# EAGLE design Emoji Board v2 (EAGLE 7.5.0)

## Sheet 1 of 3
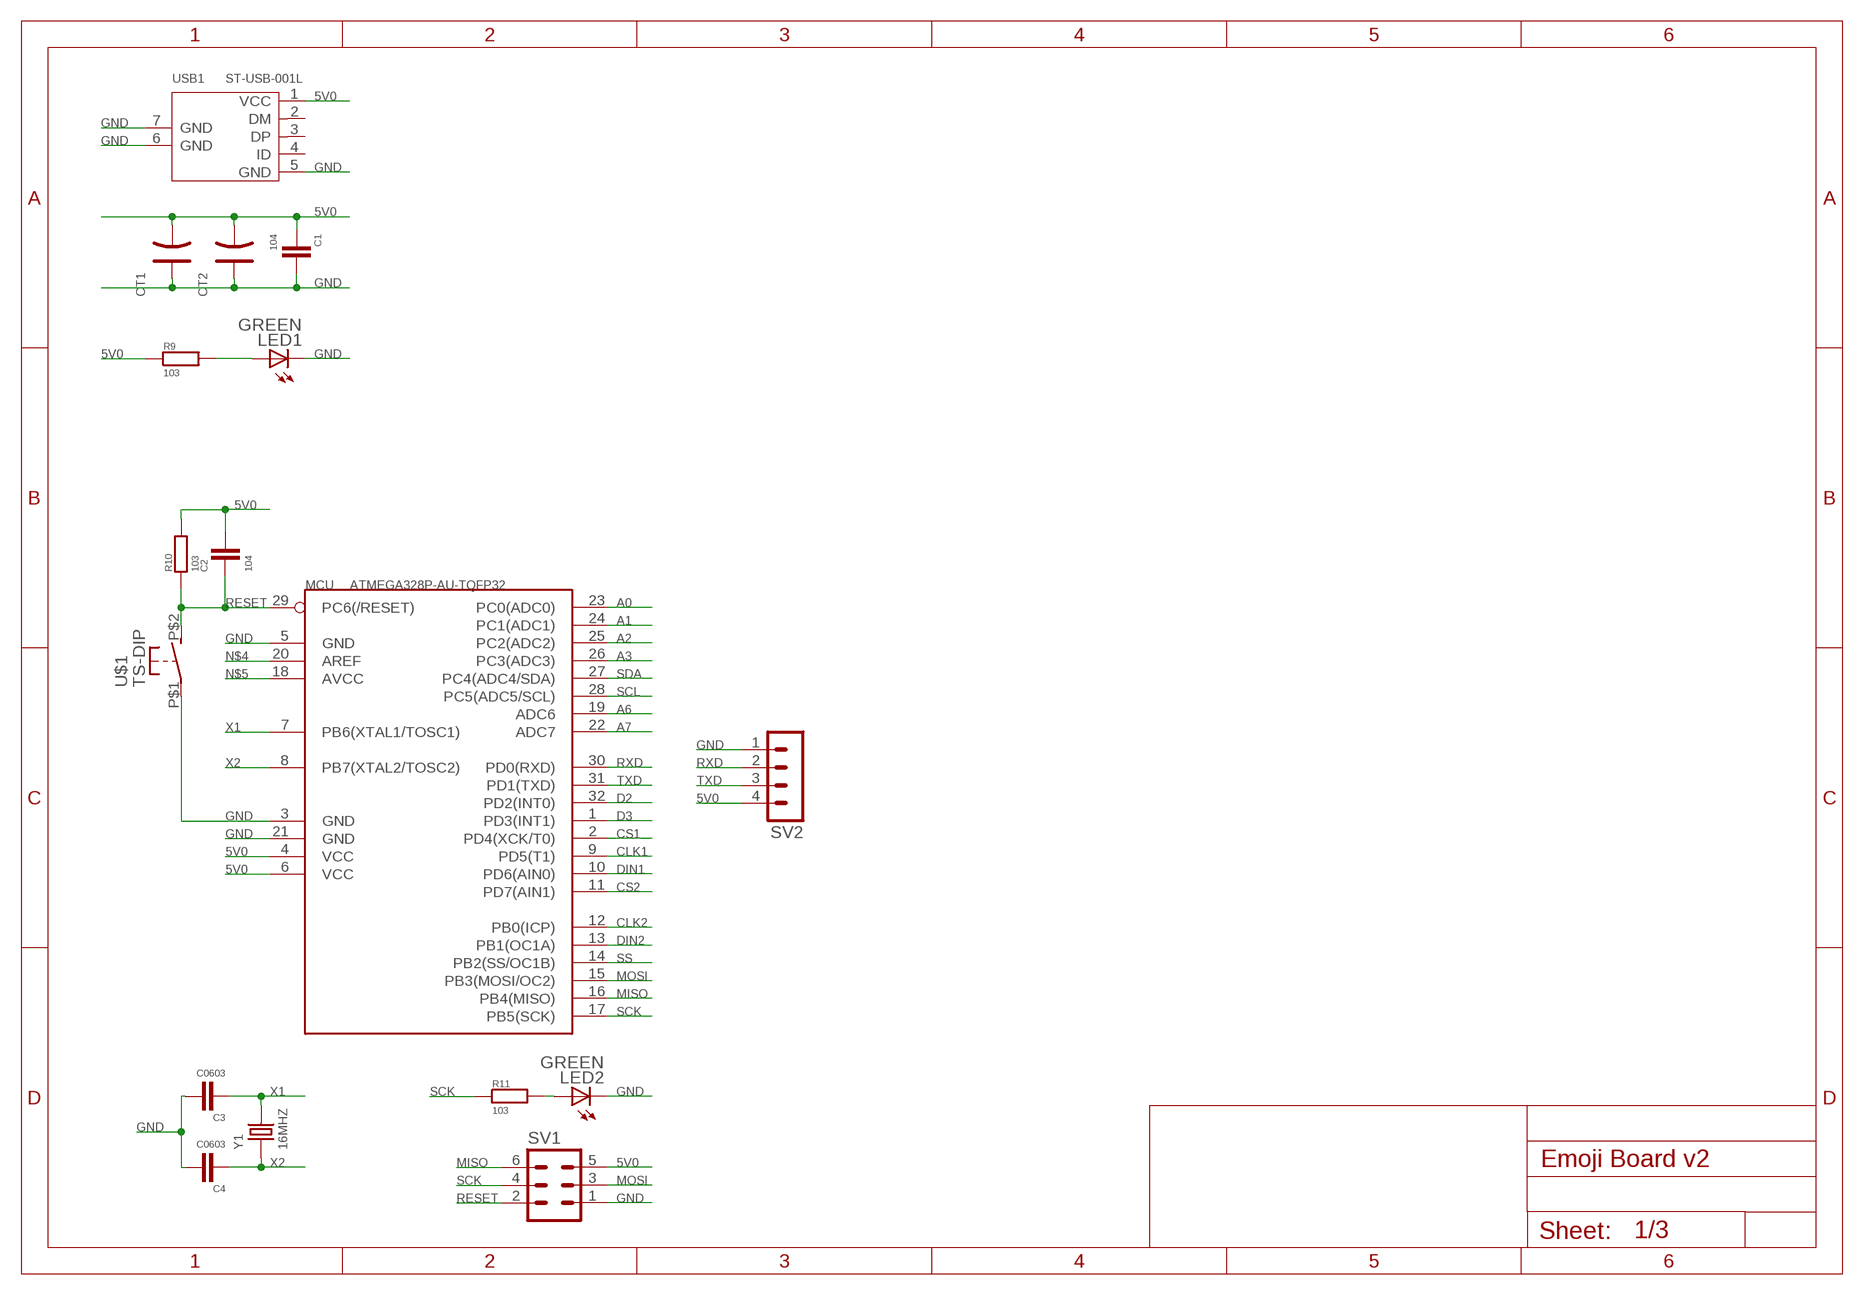
[diagram p0: schematic, sheet 1]

### Parts
C1  104  C0805  [C0805]
C2  104  C0805  [C0805]
C3  C0603  [C0603]
C4  C0603  [C0603]
CT1  ALUMINUM-SMD-100UF-50V(D6.0-H6.0MM)  [ELECTRO-SMD-C-6.0MM]
CT2  ALUMINUM-SMD-100UF-50V(D6.0-H6.0MM)  [ELECTRO-SMD-C-6.0MM]
LED1  GREEN  LEDCHIPLED_0805  [LED0805]
LED2  GREEN  LEDCHIPLED_0805  [LED0805]
MCU  ATMEGA328P-AU-TQFP32  ATMEGA328P-AU  [TQFP32]
R9  103  R0805  [R0805]
R10  103  R0805  [R0805]
R11  103  R0805  [R0805]
SV1  MA03-2  [MA03-2]
SV2  MA04-1  [MA04-1]
U$1  TS-DIP  [TS-DIP]
USB1  ST-USB-001L  MICRO-USB-SMD-5+2  [MICRO-USB-SMD-5+2]
Y1  16MHZ  DIP-CRYSTAL-16MHZ-18PF-30PPM-40R(HC49US)  [HC49US]

### Nets
5V0: C1.2 C2.1 CT1.- CT2.- MCU.4(VCC) MCU.6(VCC) R9.1 R10.2 SV1.5 SV2.4 USB1.1(VCC) ; also sheet 2,3
A0: MCU.23(PC0(ADC0))
A1: MCU.24(PC1(ADC1))
A2: MCU.25(PC2(ADC2))
A3: MCU.26(PC3(ADC3))
A6: MCU.19(ADC6)
A7: MCU.22(ADC7)
CLK1: MCU.9(PD5(T1)) ; also sheet 2
CLK2: MCU.12(PB0(ICP)) ; also sheet 3
CS1: MCU.2(PD4(XCK/T0)) ; also sheet 2
CS2: MCU.11(PD7(AIN1)) ; also sheet 3
D2: MCU.32(PD2(INT0))
D3: MCU.1(PD3(INT1))
DIN1: MCU.10(PD6(AIN0)) ; also sheet 2
DIN2: MCU.13(PB1(OC1A)) ; also sheet 3
GND: C1.1 C3.1 C4.1 CT1.+ CT2.+ LED1.C LED2.C MCU.3(GND) MCU.5(GND) MCU.21(GND) SV1.1 SV2.1 U$1.P$1(P) USB1.5(GND) USB1.6(GND) USB1.7(GND) ; also sheet 2,3
MISO: MCU.16(PB4(MISO)) SV1.6
MOSI: MCU.15(PB3(MOSI/OC2)) SV1.3
N$1: LED1.A R9.2
N$3: LED2.A R11.2
N$4: MCU.20(AREF)
N$5: MCU.18(AVCC)
RESET: C2.2 MCU.29(PC6(/RESET)) R10.1 SV1.2 U$1.P$2(S)
RXD: MCU.30(PD0(RXD)) SV2.2
SCK: MCU.17(PB5(SCK)) R11.1 SV1.4
SCL: MCU.28(PC5(ADC5/SCL))
SDA: MCU.27(PC4(ADC4/SDA))
SS: MCU.14(PB2(SS/OC1B))
TXD: MCU.31(PD1(TXD)) SV2.3
X1: C3.2 MCU.7(PB6(XTAL1/TOSC1)) Y1.2
X2: C4.2 MCU.8(PB7(XTAL2/TOSC2)) Y1.1
Unconnected: USB1.2(DM) USB1.3(DP) USB1.4(ID)

## Sheet 2 of 3
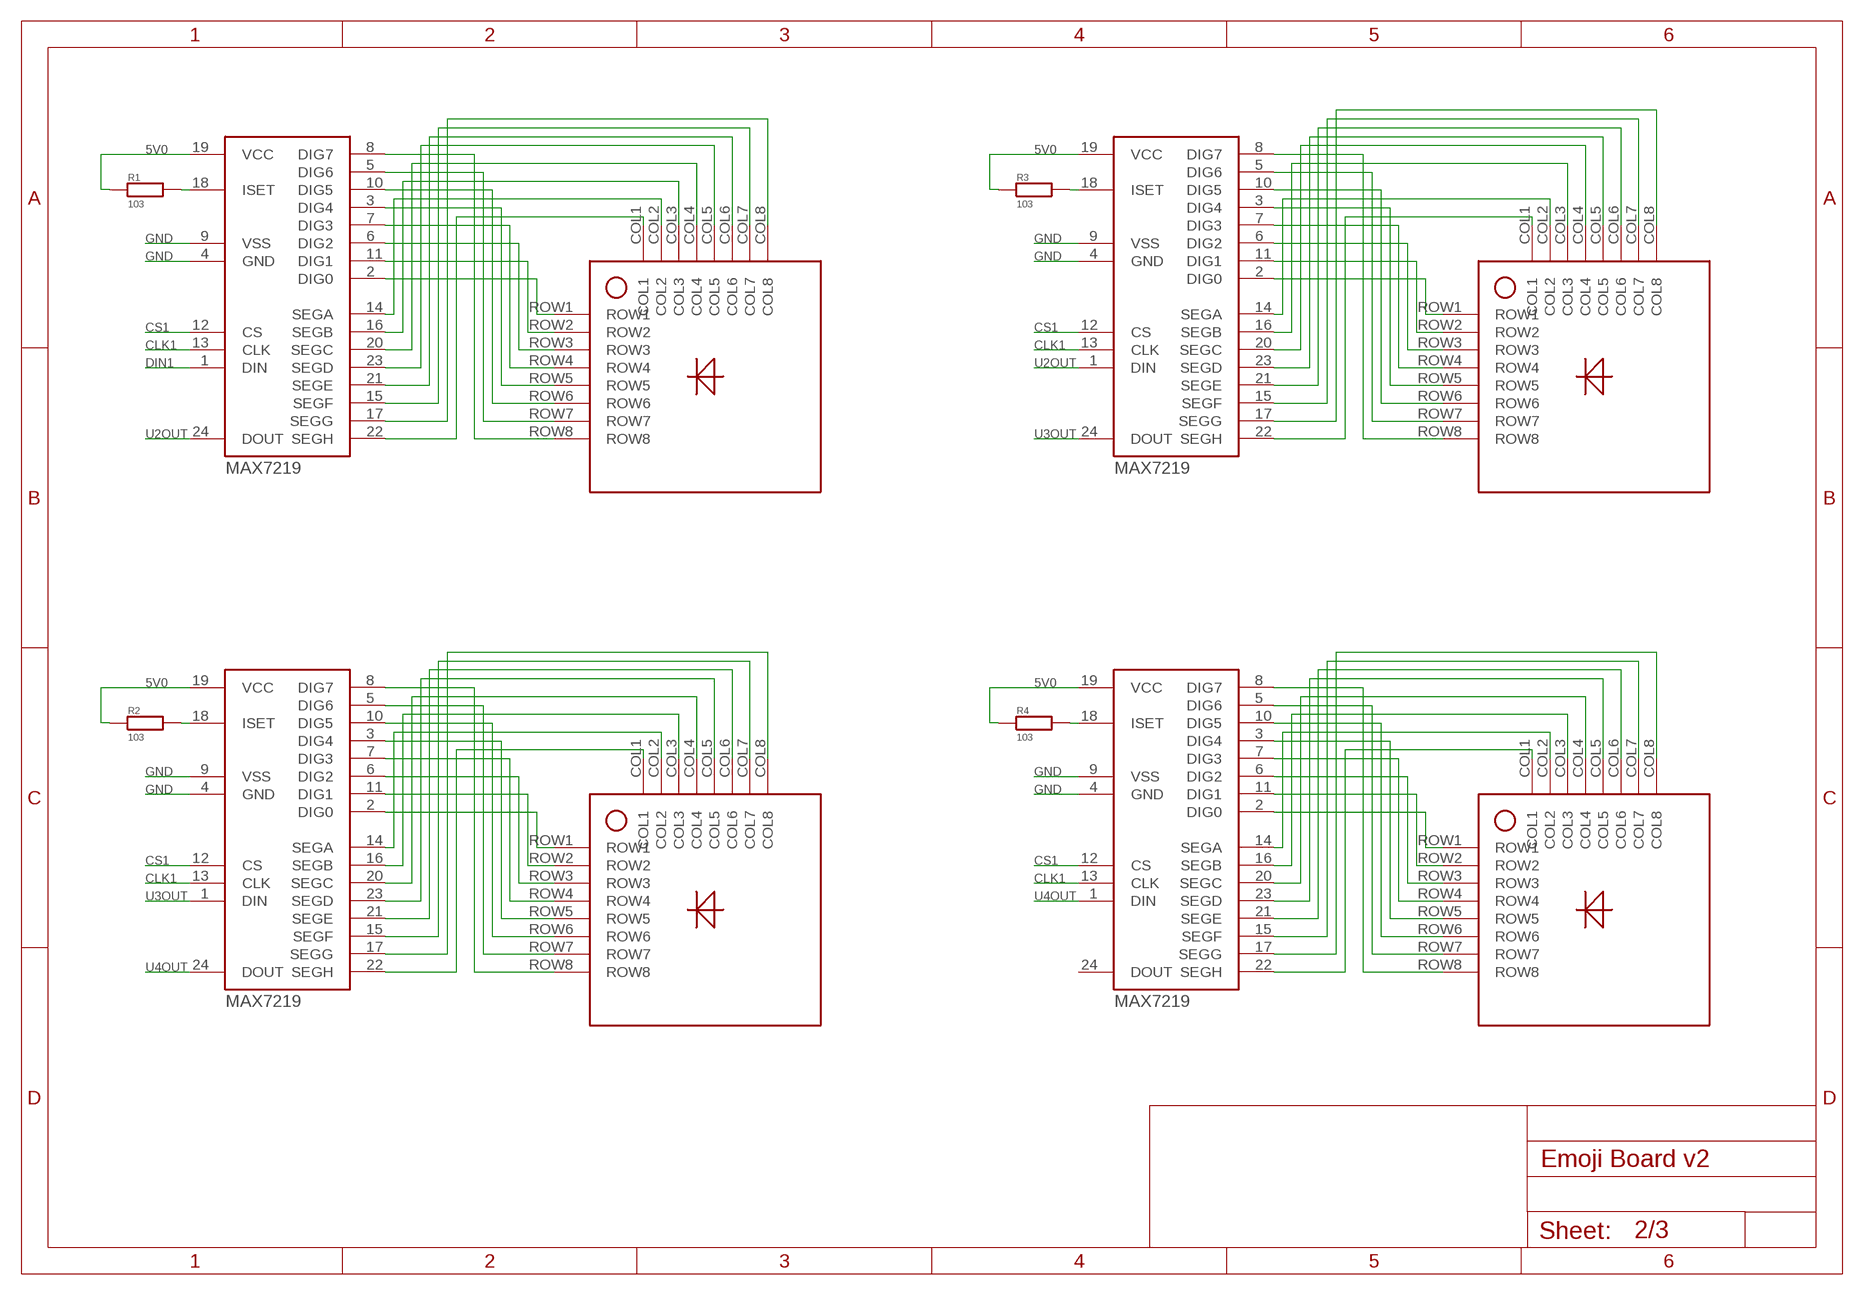
[diagram p1: schematic, sheet 2]

### Parts
R1  103  R0805  [R0805]
R2  103  R0805  [R0805]
R3  103  R0805  [R0805]
R4  103  R0805  [R0805]
T1  DOT-MATRIX-AS  [1088AS]
T2  DOT-MATRIX-AS  [1088AS]
T3  DOT-MATRIX-AS  [1088AS]
T4  DOT-MATRIX-AS  [1088AS]
U2  MAX7219  [SOP24]
U3  MAX7219  [SOP24]
U4  MAX7219  [SOP24]
U5  MAX7219  [SOP24]

### Nets
5V0: R1.1 R2.1 R3.1 R4.1 U2.19(VCC) U3.19(VCC) U4.19(VCC) U5.19(VCC) ; also sheet 1,3
CLK1: U2.13(CLK) U3.13(CLK) U4.13(CLK) U5.13(CLK) ; also sheet 1
CS1: U2.12(CS) U3.12(CS) U4.12(CS) U5.12(CS) ; also sheet 1
DIN1: U2.1(DIN) ; also sheet 1
GND: U2.4(GND) U2.9(VSS) U3.4(GND) U3.9(VSS) U4.4(GND) U4.9(VSS) U5.4(GND) U5.9(VSS) ; also sheet 1,3
N$8: T1.ROW1 U2.2(DIG0)
N$9: T1.ROW2 U2.11(DIG1)
N$10: T1.ROW3 U2.6(DIG2)
N$11: T1.ROW4 U2.7(DIG3)
N$12: T1.ROW5 U2.3(DIG4)
N$13: T1.ROW6 U2.10(DIG5)
N$14: T1.ROW7 U2.5(DIG6)
N$15: T1.ROW8 U2.8(DIG7)
N$16: T1.COL1 U2.22(SEGH)
N$17: T1.COL2 U2.14(SEGA)
N$18: T1.COL3 U2.16(SEGB)
N$19: T1.COL4 U2.20(SEGC)
N$20: T1.COL5 U2.23(SEGD)
N$21: T1.COL6 U2.21(SEGE)
N$22: T1.COL7 U2.15(SEGF)
N$23: T1.COL8 U2.17(SEGG)
N$33: T2.ROW1 U3.2(DIG0)
N$34: T2.ROW2 U3.11(DIG1)
N$35: T2.ROW3 U3.6(DIG2)
N$36: T2.ROW4 U3.7(DIG3)
N$37: T2.ROW5 U3.3(DIG4)
N$38: T2.ROW6 U3.10(DIG5)
N$39: T2.ROW7 U3.5(DIG6)
N$40: T2.ROW8 U3.8(DIG7)
N$41: T2.COL1 U3.22(SEGH)
N$42: T2.COL2 U3.14(SEGA)
N$43: T2.COL3 U3.16(SEGB)
N$44: T2.COL4 U3.20(SEGC)
N$45: T2.COL5 U3.23(SEGD)
N$46: T2.COL6 U3.21(SEGE)
N$47: T2.COL7 U3.15(SEGF)
N$48: T2.COL8 U3.17(SEGG)
N$49: T3.ROW1 U4.2(DIG0)
N$50: T3.ROW2 U4.11(DIG1)
N$51: T3.ROW3 U4.6(DIG2)
N$52: T3.ROW4 U4.7(DIG3)
N$53: T3.ROW5 U4.3(DIG4)
N$54: T3.ROW6 U4.10(DIG5)
N$55: T3.ROW7 U4.5(DIG6)
N$56: T3.ROW8 U4.8(DIG7)
N$57: T3.COL1 U4.22(SEGH)
N$58: T3.COL2 U4.14(SEGA)
N$59: T3.COL3 U4.16(SEGB)
N$60: T3.COL4 U4.20(SEGC)
N$61: T3.COL5 U4.23(SEGD)
N$62: T3.COL6 U4.21(SEGE)
N$63: T3.COL7 U4.15(SEGF)
N$64: T3.COL8 U4.17(SEGG)
N$65: T4.ROW1 U5.2(DIG0)
N$66: T4.ROW2 U5.11(DIG1)
N$67: T4.ROW3 U5.6(DIG2)
N$68: T4.ROW4 U5.7(DIG3)
N$69: T4.ROW5 U5.3(DIG4)
N$70: T4.ROW6 U5.10(DIG5)
N$71: T4.ROW7 U5.5(DIG6)
N$72: T4.ROW8 U5.8(DIG7)
N$73: T4.COL1 U5.22(SEGH)
N$74: T4.COL2 U5.14(SEGA)
N$75: T4.COL3 U5.16(SEGB)
N$76: T4.COL4 U5.20(SEGC)
N$77: T4.COL5 U5.23(SEGD)
N$78: T4.COL6 U5.21(SEGE)
N$79: T4.COL7 U5.15(SEGF)
N$80: T4.COL8 U5.17(SEGG)
N$86: R1.2 U2.18(ISET)
N$87: R2.2 U4.18(ISET)
N$88: R3.2 U3.18(ISET)
N$89: R4.2 U5.18(ISET)
U2OUT: U2.24(DOUT) U3.1(DIN)
U3OUT: U3.24(DOUT) U4.1(DIN)
U4OUT: U4.24(DOUT) U5.1(DIN)
Unconnected: U5.24(DOUT)

## Sheet 3 of 3
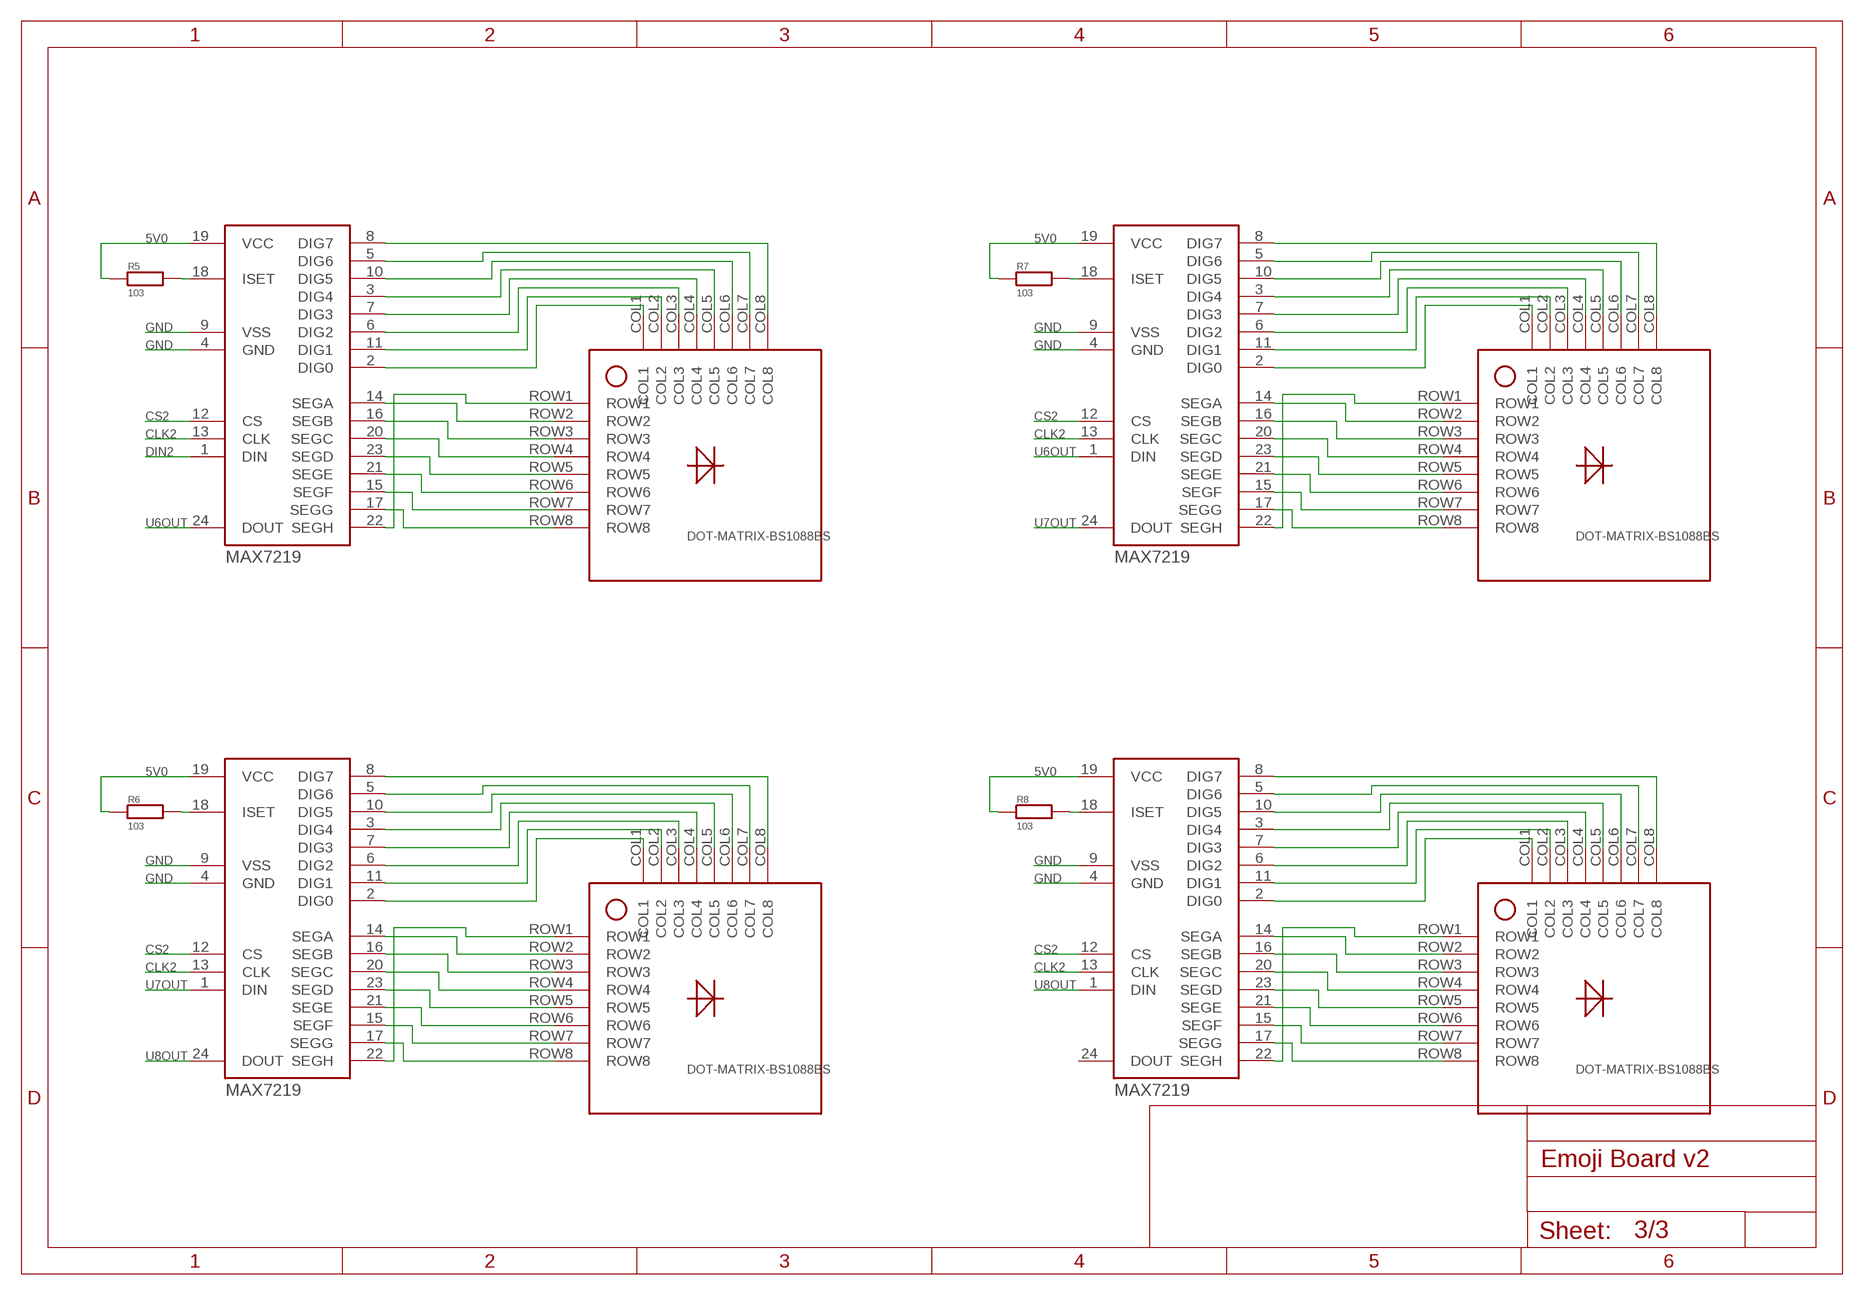
[diagram p2: schematic, sheet 3]

### Parts
R5  103  R0805  [R0805]
R6  103  R0805  [R0805]
R7  103  R0805  [R0805]
R8  103  R0805  [R0805]
T5  DOT-MATRIX-BS1088BS  [1088BS]
T6  DOT-MATRIX-BS1088BS  [1088BS]
T7  DOT-MATRIX-BS1088BS  [1088BS]
T8  DOT-MATRIX-BS1088BS  [1088BS]
U6  MAX7219  [SOP24]
U7  MAX7219  [SOP24]
U8  MAX7219  [SOP24]
U9  MAX7219  [SOP24]

### Nets
5V0: R5.1 R6.1 R7.1 R8.1 U6.19(VCC) U7.19(VCC) U8.19(VCC) U9.19(VCC) ; also sheet 1,2
CLK2: U6.13(CLK) U7.13(CLK) U8.13(CLK) U9.13(CLK) ; also sheet 1
CS2: U6.12(CS) U7.12(CS) U8.12(CS) U9.12(CS) ; also sheet 1
DIN2: U6.1(DIN) ; also sheet 1
GND: U6.4(GND) U6.9(VSS) U7.4(GND) U7.9(VSS) U8.4(GND) U8.9(VSS) U9.4(GND) U9.9(VSS) ; also sheet 1,2
N$2: R5.2 U6.18(ISET)
N$25: R6.2 U8.18(ISET)
N$81: T5.ROW8 U6.17(SEGG)
N$82: T5.ROW7 U6.15(SEGF)
N$83: T5.ROW6 U6.21(SEGE)
N$84: T5.ROW5 U6.23(SEGD)
N$85: T5.ROW4 U6.20(SEGC)
N$90: T5.ROW3 U6.16(SEGB)
N$91: T5.ROW2 U6.14(SEGA)
N$92: T5.ROW1 U6.22(SEGH)
N$93: T5.COL1 U6.2(DIG0)
N$94: T5.COL2 U6.11(DIG1)
N$95: T5.COL3 U6.6(DIG2)
N$96: T5.COL4 U6.7(DIG3)
N$97: T5.COL5 U6.3(DIG4)
N$98: T5.COL6 U6.10(DIG5)
N$99: T5.COL7 U6.5(DIG6)
N$100: T5.COL8 U6.8(DIG7)
N$101: T6.ROW8 U7.17(SEGG)
N$102: T6.ROW7 U7.15(SEGF)
N$103: T6.ROW6 U7.21(SEGE)
N$104: T6.ROW5 U7.23(SEGD)
N$105: T6.ROW4 U7.20(SEGC)
N$106: T6.ROW3 U7.16(SEGB)
N$107: T6.ROW2 U7.14(SEGA)
N$108: T6.ROW1 U7.22(SEGH)
N$109: T6.COL1 U7.2(DIG0)
N$110: T6.COL2 U7.11(DIG1)
N$111: T6.COL3 U7.6(DIG2)
N$112: T6.COL4 U7.7(DIG3)
N$113: T6.COL5 U7.3(DIG4)
N$114: T6.COL6 U7.10(DIG5)
N$115: T6.COL7 U7.5(DIG6)
N$116: T6.COL8 U7.8(DIG7)
N$117: T8.ROW8 U9.17(SEGG)
N$118: T8.ROW7 U9.15(SEGF)
N$119: T8.ROW6 U9.21(SEGE)
N$120: T8.ROW5 U9.23(SEGD)
N$121: T8.ROW4 U9.20(SEGC)
N$122: T8.ROW3 U9.16(SEGB)
N$123: T8.ROW2 U9.14(SEGA)
N$124: T8.ROW1 U9.22(SEGH)
N$125: T8.COL1 U9.2(DIG0)
N$126: T8.COL2 U9.11(DIG1)
N$127: T8.COL3 U9.6(DIG2)
N$128: T8.COL4 U9.7(DIG3)
N$129: T8.COL5 U9.3(DIG4)
N$130: T8.COL6 U9.10(DIG5)
N$131: T8.COL7 U9.5(DIG6)
N$132: T8.COL8 U9.8(DIG7)
N$133: T7.ROW8 U8.17(SEGG)
N$134: T7.ROW7 U8.15(SEGF)
N$135: T7.ROW6 U8.21(SEGE)
N$136: T7.ROW5 U8.23(SEGD)
N$137: T7.ROW4 U8.20(SEGC)
N$138: T7.ROW3 U8.16(SEGB)
N$139: T7.ROW2 U8.14(SEGA)
N$140: T7.ROW1 U8.22(SEGH)
N$141: T7.COL1 U8.2(DIG0)
N$142: T7.COL2 U8.11(DIG1)
N$143: T7.COL3 U8.6(DIG2)
N$144: T7.COL4 U8.7(DIG3)
N$145: T7.COL5 U8.3(DIG4)
N$146: T7.COL6 U8.10(DIG5)
N$147: T7.COL7 U8.5(DIG6)
N$148: T7.COL8 U8.8(DIG7)
N$149: R7.2 U7.18(ISET)
N$150: R8.2 U9.18(ISET)
U6OUT: U6.24(DOUT) U7.1(DIN)
U7OUT: U7.24(DOUT) U8.1(DIN)
U8OUT: U8.24(DOUT) U9.1(DIN)
Unconnected: U9.24(DOUT)

## Library data of the parts
C1-C4 = RCLDA:C: CAPACITOR
CT1 CT2 = RCLDA:ALUMINUM-SMD-100UF-50V(D6.0-H6.0MM): 302030090; MPN: CS1H101M-CRE77; VALUE: 100UF
LED1 LED2 = Display:LED
MCU = Chip:ATMEGA328P-AU: 310010049; MPN: ATMEGA328P-AU
R1-R11 = RCLDA:R: RESISTOR
SV1 = Pin-Header:MA03-2: PIN HEADER; OC_FARNELL: unknown; OC_NEWARK: unknown
SV2 = Pin-Header:MA04-1: PIN HEADER; OC_FARNELL: unknown; OC_NEWARK: unknown
T1-T4 = Display:DOT-MATRIX-AS
T5-T8 = Display:DOT-MATRIX-BS
U2-U9 = Chip:MAX7219
U$1 = Button:TS-DIP
USB1 = Socket:MICRO-USB-SMD-5+2: 320010012; MPN: ST-USB-001L
Y1 = Crystal:DIP-CRYSTAL-16MHZ-18PF-30PPM-40R(HC49US): 306010014; MPN: HC-49US 16.000MHz

## Board
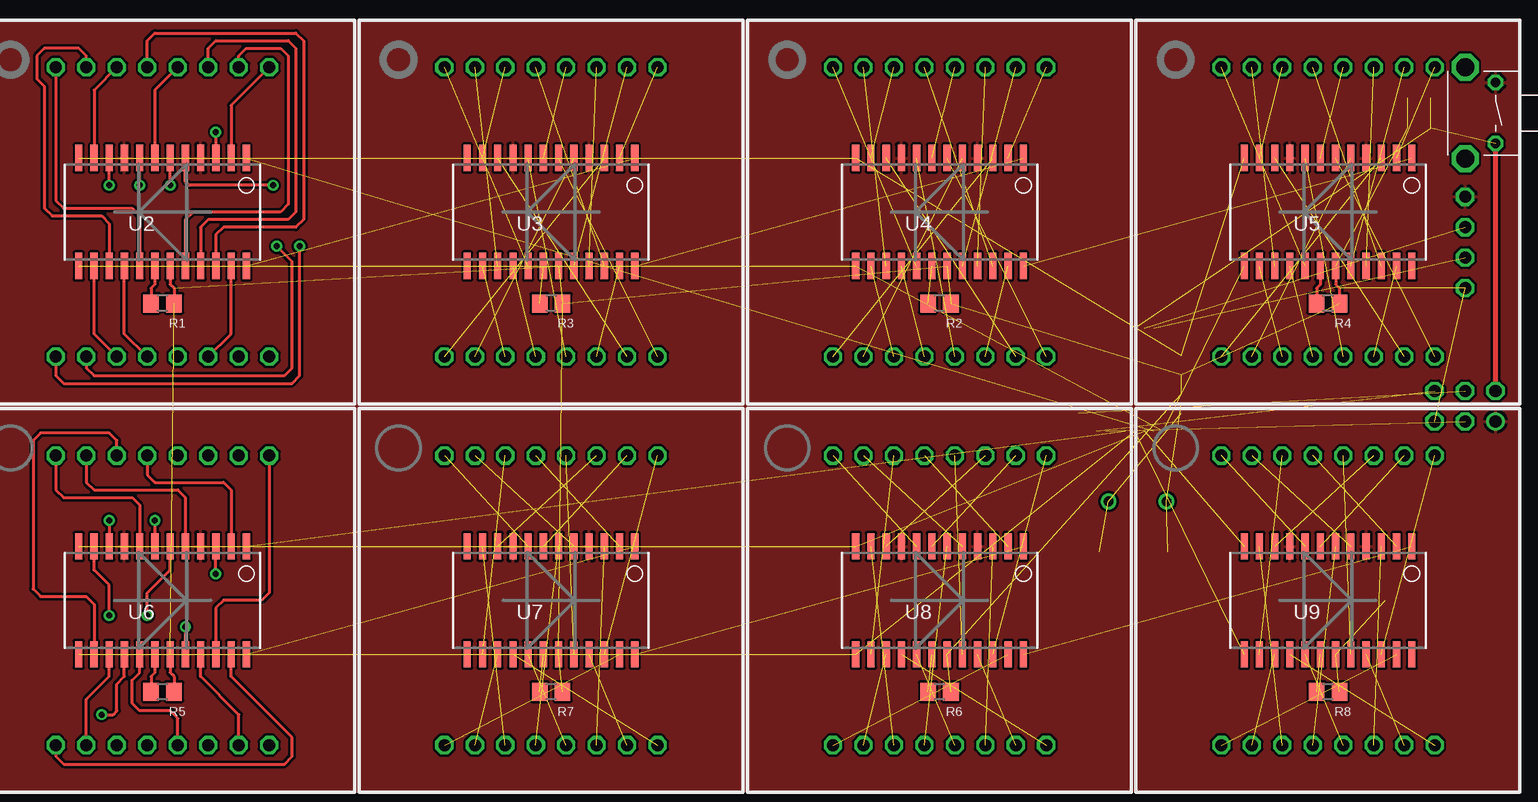
[diagram p3: board, top side]
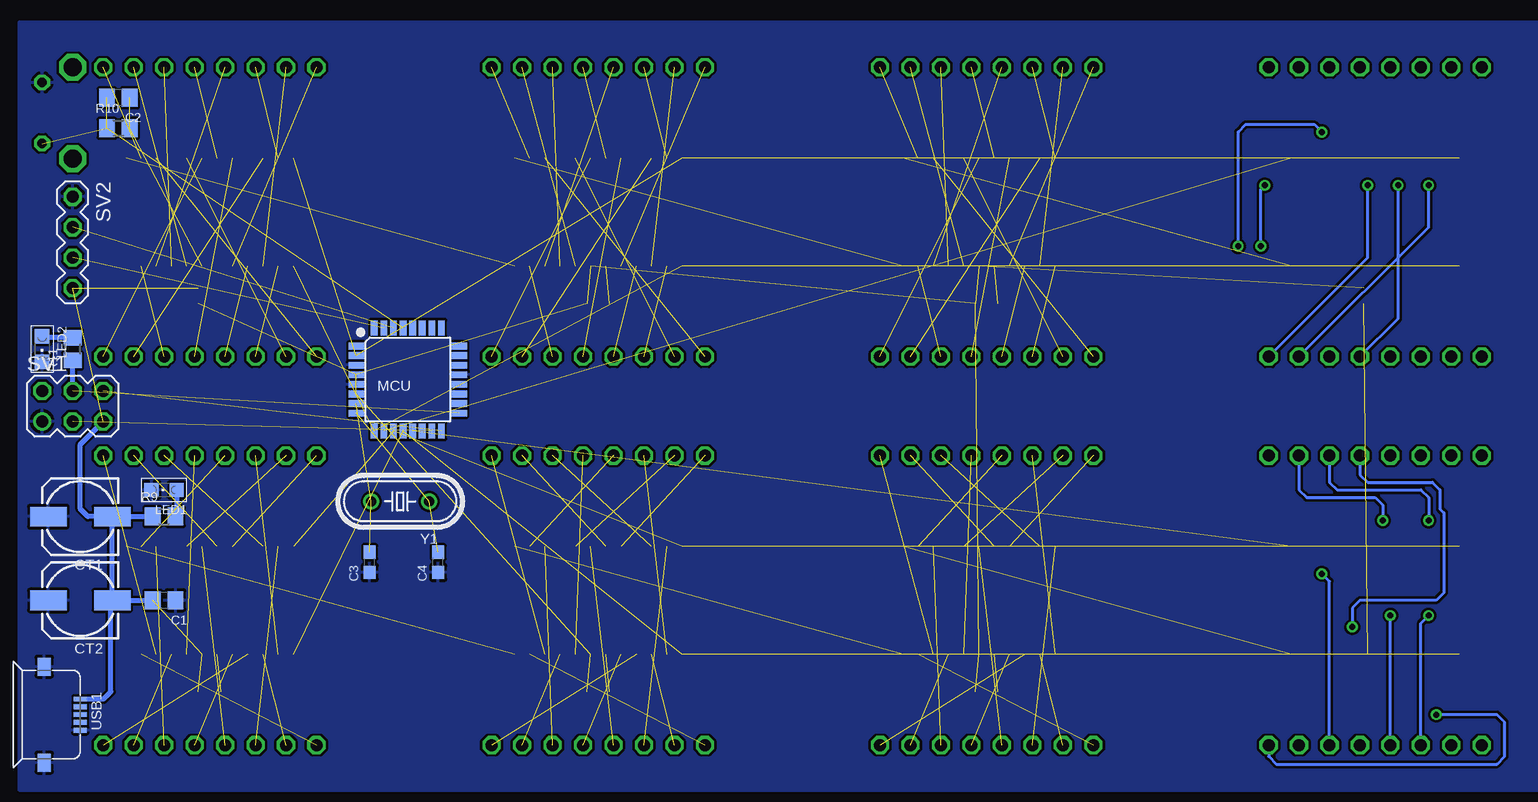
[diagram p4: board, bottom side, seen from below]

No outline drawn. Coordinates in mm, seen from the top.
Copper layers (1*16): Top 0.035mm / dielectric 1.5mm / Bottom 0.035mm
Design rules "default": minimum track width 10mil, minimum drill 24mil, track to track 8mil, track to pad 8mil, pad to pad 8mil, via to via 8mil, smd to smd 8mil, copper to edge 40mil, drill to drill 8mil, minimum pad ring 10mil, minimum via ring 8mil, stop-mask expansion 4mil, vias tented up to drill 0mil, thermal gap 10mil

### Footprints (pad centres in the part's own frame; a part is rotated, then mirrored left to right if it is on the bottom)
C0805 = smd 1.3 x 1.5: 1 -0.95,0; 2 0.95,0
C0603 = smd 1.1 x 1: 1 -0.85,0; 2 0.85,0
ELECTRO-SMD-C-6.0MM = smd 3.048 x 1.651: + 2.667,0; - -2.667,0
LED0805 = smd 1.2 x 1.2: A -1.05,0; C 1.05,0
TQFP32 = smd 1.27 x 0.559: 1 -4.293,2.8; 2 -4.293,2; 3 -4.293,1.2; 4 -4.293,0.4; 5 -4.293,-0.4; 6 -4.293,-1.2; 7 -4.293,-2; 8 -4.293,-2.8; 17 4.293,-2.8; 18 4.293,-2; 19 4.293,-1.2; 20 4.293,-0.4; 21 4.293,0.4; 22 4.293,1.2; 23 4.293,2; 24 4.293,2.8 | smd 0.559 x 1.27: 9 -2.8,-4.293; 10 -2,-4.293; 11 -1.2,-4.293; 12 -0.4,-4.293; 13 0.4,-4.293; 14 1.2,-4.293; 15 2,-4.293; 16 2.8,-4.293; 25 2.8,4.293; 26 2,4.293; 27 1.2,4.293; 28 0.4,4.293; 29 -0.4,4.293; 30 -1.2,4.293; 31 -2,4.293; 32 -2.8,4.293
R0805 = smd 1.3 x 1.5: 1 -0.95,0; 2 0.95,0
MA03-2 = drill 1.016: 1 -2.54,-1.27 | drill 1.016 octagon: 2 -2.54,1.27; 3 0,-1.27; 4 0,1.27; 5 2.54,-1.27; 6 2.54,1.27
MA04-1 = drill 1.016 octagon: 1 -3.81,0; 2 -1.27,0; 3 1.27,0; 4 3.81,0
1088AS = drill 1 octagon: COL1 -1.27,12.065; COL2 -3.81,-12.065; COL3 -1.27,-12.065; COL4 6.35,12.065; COL5 3.81,-12.065; COL6 3.81,12.065; COL7 -6.35,12.065; COL8 -8.89,12.065; ROW1 8.89,12.065; ROW2 -3.81,12.065; ROW3 8.89,-12.065; ROW4 1.27,12.065; ROW5 -8.89,-12.065; ROW6 6.35,-12.065; ROW7 -6.35,-12.065; ROW8 1.27,-12.065
1088BS = drill 1 octagon: COL1 -1.27,12.065; COL2 -3.81,-12.065; COL3 -1.27,-12.065; COL4 6.35,12.065; COL5 3.81,-12.065; COL6 3.81,12.065; COL7 -6.35,12.065; COL8 -8.89,12.065; ROW1 8.89,12.065; ROW2 -3.81,12.065; ROW3 8.89,-12.065; ROW4 1.27,12.065; ROW5 -8.89,-12.065; ROW6 6.35,-12.065; ROW7 -6.35,-12.065; ROW8 1.27,-12.065
SOP24 = smd 0.6 x 2.2: 1 -6.985,-4.5; 2 -5.715,-4.5; 3 -4.445,-4.5; 4 -3.175,-4.5; 5 -1.905,-4.5; 6 -0.635,-4.5; 7 0.635,-4.5; 8 1.905,-4.5; 9 3.175,-4.5; 10 4.445,-4.5; 11 5.715,-4.5; 12 6.985,-4.5; 13 6.985,4.5; 14 5.715,4.5; 15 4.445,4.5; 16 3.175,4.5; 17 1.905,4.5; 18 0.635,4.5; 19 -0.635,4.5; 20 -1.905,4.5; 21 -3.175,4.5; 22 -4.445,4.5; 23 -5.715,4.5; 24 -6.985,4.5
TS-DIP = drill 0.8 octagon: P$1 -2.54,0; P$2 2.54,0 | drill 1.5 octagon: P$3 -3.81,-2.54; P$4 3.81,-2.54
MICRO-USB-SMD-5+2 = smd 0.4 x 1.05: 1 -1.3,0; 2 -0.65,0; 3 0,0; 4 0.65,0; 5 1.3,0 | smd 1.5 x 1.1: 6 4,-3; 7 -4,-3
HC49US = drill 0.813: 1 -2.413,0; 2 2.413,0

### Placement (x,y rotation side)
C1  116.84,15.88 180 bottom
C2  120.65,57.78 180 bottom
C3  99.69,19.05 90 bottom
C4  93.98,19.05 90 bottom
CT1  123.83,22.86 180 bottom
CT2  123.83,15.88 180 bottom
LED1  116.84,25.08 180 bottom
LED2  127,36.83 270 bottom
MCU  96.52,34.29 0 bottom
R1  15.88,40.64 180 top
R2  80.64,40.64 180 top
R3  48.26,40.64 180 top
R4  113.03,40.64 180 top
R5  15.88,8.26 180 top
R6  80.64,8.26 180 top
R7  48.26,8.26 180 top
R8  113.03,8.26 180 top
R9  116.84,22.86 0 bottom
R10  120.65,55.24 0 bottom
R11  124.46,36.83 90 bottom
SV1  124.46,32.07 0 bottom
SV2  124.46,45.72 270 bottom
T1  15.88,48.26 0 top
T2  48.26,48.26 0 top
T3  80.64,48.26 0 top
T4  113.03,48.26 0 top
T5  15.88,15.88 0 top
T6  48.26,15.88 0 top
T7  80.64,15.88 0 top
T8  113.03,15.88 0 top
U2  15.88,48.26 180 top
U3  48.26,48.26 180 top
U4  80.64,48.26 180 top
U5  113.03,48.26 180 top
U6  15.88,15.88 180 top
U7  48.26,15.88 180 top
U8  80.64,15.88 180 top
U9  113.03,15.88 180 top
U$1  127,56.52 270 top
USB1  123.83,6.35 270 bottom
Y1  97.16,24.13 180 bottom

### Tracks (layer width: path | path; a pad name or v marks a point on that pad's centre or on a via)
5V0  (18 unrouted)
  Top 0.254: U2.19 16.51,42.23 16.83,41.91 R1.1 | U5.19 113.67,42.23 113.98,41.91 R4.1 | U6.19 16.51,9.84 16.83,9.53 R5.1
  Bottom 0.406: USB1.1 121.89,7.65 121.28,8.26 121.28,15.75 CT2.- | CT2.- C1.2 | CT2.- CT1.- | CT1.- R9.1 | CT1.- 123.19,22.86 123.83,23.5 123.83,28.89 SV1.5
CLK1  (4 unrouted)
CLK2  (4 unrouted)
CS1  (4 unrouted)
CS2  (4 unrouted)
DIN1  (1 unrouted)
DIN2  (1 unrouted)
GND
  pour Top: 0,0 0,64.14 128.91,64.14 128.91,0
  pour Bottom: 0,0 128.91,0 128.91,64.14 0,64.14
MISO  (1 unrouted)
MOSI  (1 unrouted)
N$1
  Bottom 0.406: LED1.A 115.79,22.96 R9.2
N$2
  Top 0.254: U6.18 15.24,9.84 14.92,9.53 R5.2
N$3
  Bottom 0.406: R11.2 126.9,37.78 LED2.A
N$8
  Top 0.254: T1.ROW1 21.59,57.15 U2.2
N$9
  Top 0.254: T1.ROW2 10.16,58.42 U2.11
N$10  (via drill 0.5)
  Top 0.254: v16.51,50.48 U2.6
  Bottom 0.254: T1.ROW3 16.51,44.45 v16.51,50.48
N$11
  Top 0.254: T1.ROW4 15.24,58.42 U2.7
N$12  (via drill 0.5)
  Top 0.254: T1.ROW5 6.99,34.61 7.62,33.97 26.67,33.97 27.3,34.61 v27.3,45.4 | v20.32,54.93 U2.3
  Bottom 0.254: v27.3,45.4 27.3,54.93 26.67,55.56 20.95,55.56 v20.32,54.93
N$13  (via drill 0.5)
  Top 0.254: v11.43,50.48 U2.10
  Bottom 0.254: T1.ROW6 11.43,46.99 v11.43,50.48
N$14  (via drill 0.5)
  Top 0.254: T1.ROW7 9.53,35.24 10.16,34.61 26.04,34.61 26.67,35.24 26.67,44.13 v25.4,45.4 | v25.08,50.48 18.1,50.48 17.78,50.8 U2.5
  Bottom 0.254: v25.4,45.4 25.4,50.16 v25.08,50.48
N$15  (via drill 0.5)
  Top 0.254: v13.97,50.48 U2.8
  Bottom 0.254: T1.ROW8 13.97,39.37 v13.97,50.48
N$16
  Top 0.254: T1.COL1 14.61,62.55 15.24,63.18 26.99,63.18 27.62,62.55 27.62,47.62 26.99,46.99 20.95,46.99 20.32,46.35 U2.22
N$17
  Top 0.254: T1.COL2 10.16,38.1 U2.14
N$18
  Top 0.254: T1.COL3 12.7,38.1 U2.16
N$19
  Top 0.254: T1.COL4 22.23,61.28 22.86,61.91 25.72,61.91 26.35,61.28 26.35,48.9 25.72,48.26 18.41,48.26 17.78,47.62 U2.20
N$20
  Top 0.254: T1.COL5 21.59,38.1 U2.23
N$21
  Top 0.254: T1.COL6 19.68,61.91 20.32,62.55 26.35,62.55 26.99,61.91 26.99,48.26 26.35,47.62 19.68,47.62 19.05,46.99 U2.21
N$22
  Top 0.254: T1.COL7 9.53,61.28 8.89,61.91 6.03,61.91 5.4,61.28 5.4,59.37 6.03,58.74 6.03,48.58 6.67,47.94 10.79,47.94 11.43,47.31 U2.15
N$23
  Top 0.254: T1.COL8 6.99,49.21 7.62,48.58 13.34,48.58 13.97,47.94 U2.17
N$25  (1 unrouted)
N$33  (1 unrouted)
N$34  (1 unrouted)
N$35  (1 unrouted)
N$36  (1 unrouted)
N$37  (1 unrouted)
N$38  (1 unrouted)
N$39  (1 unrouted)
N$40  (1 unrouted)
N$41  (1 unrouted)
N$42  (1 unrouted)
N$43  (1 unrouted)
N$44  (1 unrouted)
N$45  (1 unrouted)
N$46  (1 unrouted)
N$47  (1 unrouted)
N$48  (1 unrouted)
N$49  (1 unrouted)
N$50  (1 unrouted)
N$51  (1 unrouted)
N$52  (1 unrouted)
N$53  (1 unrouted)
N$54  (1 unrouted)
N$55  (1 unrouted)
N$56  (1 unrouted)
N$57  (1 unrouted)
N$58  (1 unrouted)
N$59  (1 unrouted)
N$60  (1 unrouted)
N$61  (1 unrouted)
N$62  (1 unrouted)
N$63  (1 unrouted)
N$64  (1 unrouted)
N$65  (1 unrouted)
N$66  (1 unrouted)
N$67  (1 unrouted)
N$68  (1 unrouted)
N$69  (1 unrouted)
N$70  (1 unrouted)
N$71  (1 unrouted)
N$72  (1 unrouted)
N$73  (1 unrouted)
N$74  (1 unrouted)
N$75  (1 unrouted)
N$76  (1 unrouted)
N$77  (1 unrouted)
N$78  (1 unrouted)
N$79  (1 unrouted)
N$80  (1 unrouted)
N$81
  Top 0.254: T5.ROW8 17.14,6.03 16.51,6.67 13.97,6.67 13.34,7.3 13.34,9.21 13.97,9.84 U6.17
N$82
  Top 0.254: T5.ROW7 9.53,7.62 11.43,9.53 U6.15
N$83
  Top 0.254: T5.ROW6 22.23,6.35 19.05,9.53 U6.21
N$84
  Top 0.254: T5.ROW5 6.99,2.86 7.62,2.22 26.04,2.22 26.67,2.86 26.67,4.45 21.59,9.53 U6.23
N$85  (via drill 0.5)
  Top 0.254: v17.78,13.65 U6.20
  Bottom 0.254: T5.ROW4 17.14,26.35 16.51,25.72 11.11,25.72 10.48,25.08 10.48,23.5 10.16,23.18 10.16,16.51 10.79,15.88 17.14,15.88 17.78,15.24 v17.78,13.65
N$86
  Top 0.254: U2.18 15.24,42.23 14.92,41.91 R1.2
N$87  (1 unrouted)
N$88  (1 unrouted)
N$89
  Top 0.254: U5.18 112.39,42.23 112.08,41.91 R4.2
N$90  (via drill 0.5)
  Top 0.254: v10.79,6.35 11.75,6.35 12.06,6.67 12.06,8.89 12.7,9.53 U6.16
  Bottom 0.254: T5.ROW3 24.77,2.86 24.13,2.22 5.71,2.22 5.08,2.86 5.08,5.71 5.71,6.35 v10.79,6.35
N$91
  Top 0.254: T5.ROW2 12.06,29.21 11.43,29.84 5.71,29.84 5.08,29.21 5.08,16.83 5.71,16.19 9.53,16.19 10.16,15.56 U6.14
N$92
  Top 0.254: T5.ROW1 24.77,16.51 24.13,15.88 20.95,15.88 20.32,15.24 U6.22
N$93
  Top 0.254: T5.COL1 14.61,26.35 15.24,25.72 20.95,25.72 21.59,25.08 U6.2
N$94  (via drill 0.5)
  Top 0.254: v11.43,14.61 11.43,17.14 10.16,18.41 U6.11
  Bottom 0.254: T5.COL2 12.06,13.97 v11.43,14.61
N$95  (via drill 0.5)
  Top 0.254: v14.61,14.61 14.61,16.51 16.51,18.41 U6.6
  Bottom 0.254: T5.COL3 v14.61,14.61
N$96  (via drill 0.5)
  Top 0.254: v15.24,22.54 U6.7
  Bottom 0.254: T5.COL4 22.23,25.08 21.59,24.45 15.88,24.45 15.24,23.81 v15.24,22.54
N$97  (via drill 0.5)
  Top 0.254: v20.32,18.1 U6.3
  Bottom 0.254: T5.COL5 19.68,17.46 v20.32,18.1
N$98  (via drill 0.5)
  Top 0.254: v11.43,22.54 U6.10
  Bottom 0.254: T5.COL6 19.68,25.72 19.05,25.08 12.06,25.08 11.43,24.45 v11.43,22.54
N$99
  Top 0.254: T5.COL7 9.53,25.72 10.16,25.08 17.14,25.08 17.78,24.45 U6.5
N$100
  Top 0.254: T5.COL8 6.99,25.08 7.62,24.45 13.34,24.45 13.97,23.81 U6.8
N$101  (1 unrouted)
N$102  (1 unrouted)
N$103  (1 unrouted)
N$104  (1 unrouted)
N$105  (1 unrouted)
N$106  (1 unrouted)
N$107  (1 unrouted)
N$108  (1 unrouted)
N$109  (1 unrouted)
N$110  (1 unrouted)
N$111  (1 unrouted)
N$112  (1 unrouted)
N$113  (1 unrouted)
N$114  (1 unrouted)
N$115  (1 unrouted)
N$116  (1 unrouted)
N$117  (1 unrouted)
N$118  (1 unrouted)
N$119  (1 unrouted)
N$120  (1 unrouted)
N$121  (1 unrouted)
N$122  (1 unrouted)
N$123  (1 unrouted)
N$124  (1 unrouted)
N$125  (1 unrouted)
N$126  (1 unrouted)
N$127  (1 unrouted)
N$128  (1 unrouted)
N$129  (1 unrouted)
N$130  (1 unrouted)
N$131  (1 unrouted)
N$132  (1 unrouted)
N$133  (1 unrouted)
N$134  (1 unrouted)
N$135  (1 unrouted)
N$136  (1 unrouted)
N$137  (1 unrouted)
N$138  (1 unrouted)
N$139  (1 unrouted)
N$140  (1 unrouted)
N$141  (1 unrouted)
N$142  (1 unrouted)
N$143  (1 unrouted)
N$144  (1 unrouted)
N$145  (1 unrouted)
N$146  (1 unrouted)
N$147  (1 unrouted)
N$148  (1 unrouted)
N$149  (1 unrouted)
N$150  (1 unrouted)
RESET  (3 unrouted)
  Top 0.406: SV1.2 U$1.P$2
RXD  (1 unrouted)
SCK  (1 unrouted)
  Bottom 0.406: SV1.4 R11.1
TXD  (1 unrouted)
U2OUT  (1 unrouted)
U3OUT  (1 unrouted)
U4OUT  (1 unrouted)
U6OUT  (1 unrouted)
U7OUT  (1 unrouted)
U8OUT  (1 unrouted)
X1  (2 unrouted)
X2  (2 unrouted)